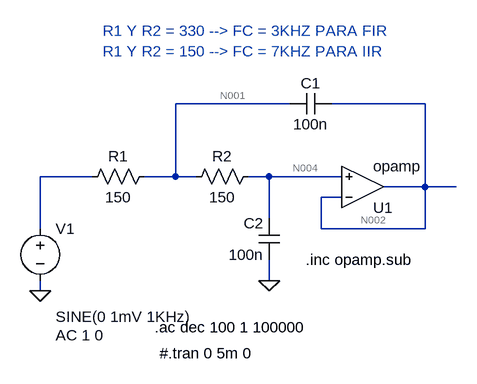
[diagram p0: schematic TPLab2_Grupo2_FiltroAntialiasingSallenKey_Simulacion.asc]
TPLab2_Grupo2_FiltroAntialiasingSallenKey_Simulacion.asc, the LTspice schematic file:
Version 4
SHEET 1 1108 680
WIRE 240 -80 64 -80
WIRE 448 -80 304 -80
WIRE -64 32 -144 32
WIRE 64 32 64 -80
WIRE 64 32 16 32
WIRE 96 32 64 32
WIRE 208 32 176 32
WIRE 320 32 208 32
WIRE 448 48 448 -80
WIRE 448 48 384 48
WIRE 496 48 448 48
WIRE 320 64 288 64
WIRE 208 96 208 32
WIRE -144 112 -144 32
WIRE 288 112 288 64
WIRE 448 112 448 48
WIRE 448 112 288 112
WIRE 208 192 208 160
WIRE -144 208 -144 192
FLAG 208 192 0
FLAG -144 208 0
SYMBOL voltage -144 96 R0
WINDOW 123 24 180 Left 2
WINDOW 39 0 0 Left 0
WINDOW 3 24 152 Left 2
SYMATTR Value2 AC 1 0
SYMATTR Value SINE(0 1mV 1KHz)
SYMATTR InstName V1
SYMBOL res 32 16 R90
WINDOW 0 0 56 VBottom 2
WINDOW 3 32 56 VTop 2
SYMATTR InstName R1
SYMATTR Value 150
SYMBOL res 192 16 R90
WINDOW 0 0 56 VBottom 2
WINDOW 3 32 56 VTop 2
SYMATTR InstName R2
SYMATTR Value 150
SYMBOL OpAmps\\opamp 352 112 M180
SYMATTR InstName U1
SYMBOL cap 304 -96 R90
WINDOW 0 0 32 VBottom 2
WINDOW 3 32 32 VTop 2
SYMATTR InstName C1
SYMATTR Value 100n
SYMBOL cap 224 160 R180
WINDOW 0 24 56 Left 2
WINDOW 3 24 8 Left 2
SYMATTR InstName C2
SYMATTR Value 100n
TEXT 32 264 Left 2 !.ac dec 100 1 100000
TEXT 264 160 Left 2 !.inc opamp.sub
TEXT -48 -192 Left 2 ;R1 Y R2 = 330 --> FC = 3KHZ PARA FIR\nR1 Y R2 = 150 --> FC = 7KHZ PARA IIR
TEXT 40 304 Left 2 !#.tran 0 5m 0

The netlist it stands for:
* TPLab2_Grupo2_FiltroAntialiasingSallenKey_Simulacion.asc
V1 N003 0 SINE(0 1mV 1KHz) AC 1 0
R1 N001 N003 150
R2 N004 N001 150
XU1 N002 N004 N002 opamp Aol=100K GBW=10Meg  ; pins invin noninvin out
C1 N002 N001 100n
C2 0 N004 100n
.ac dec 100 1 100000
.inc opamp.sub
* R1 Y R2 = 330 --> FC = 3KHZ PARA FIR
* R1 Y R2 = 150 --> FC = 7KHZ PARA IIR
#.tran 0 5m 0
.backanno
.end

* Results of the author's LTspice run, read from the files saved beside the schematic
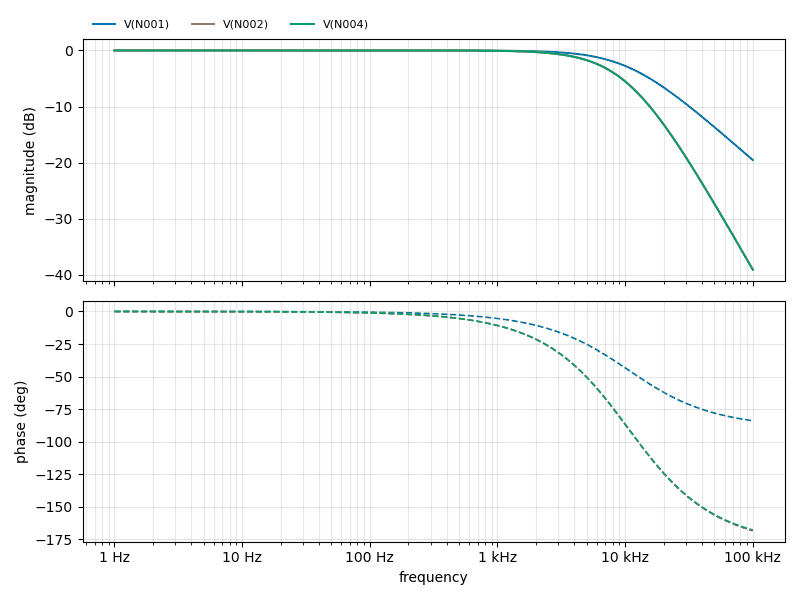
[diagram p1: AC Analysis of TPLab2_Grupo2_FiltroAntialiasingSallenKey_Simulacion.asc, plotted from the saved traces]
* AC Analysis, 1 run:
*   V(N001): -0.00 dB at 1 Hz, -19.54 dB at 100 kHz, peak -0.00 dB at 1 Hz, 3 dB below the peak at 10.61 kHz
*   V(N002): -0.00 dB at 1 Hz, -39.08 dB at 100 kHz, peak -0.00 dB at 1 Hz, 3 dB below the peak at 6.83 kHz
*   V(N004): -0.00 dB at 1 Hz, -39.08 dB at 100 kHz, peak -0.00 dB at 1 Hz, 3 dB below the peak at 6.83 kHz